# EAGLE design ESP32-DevBoard-Prototype (EAGLE 9.5.2)
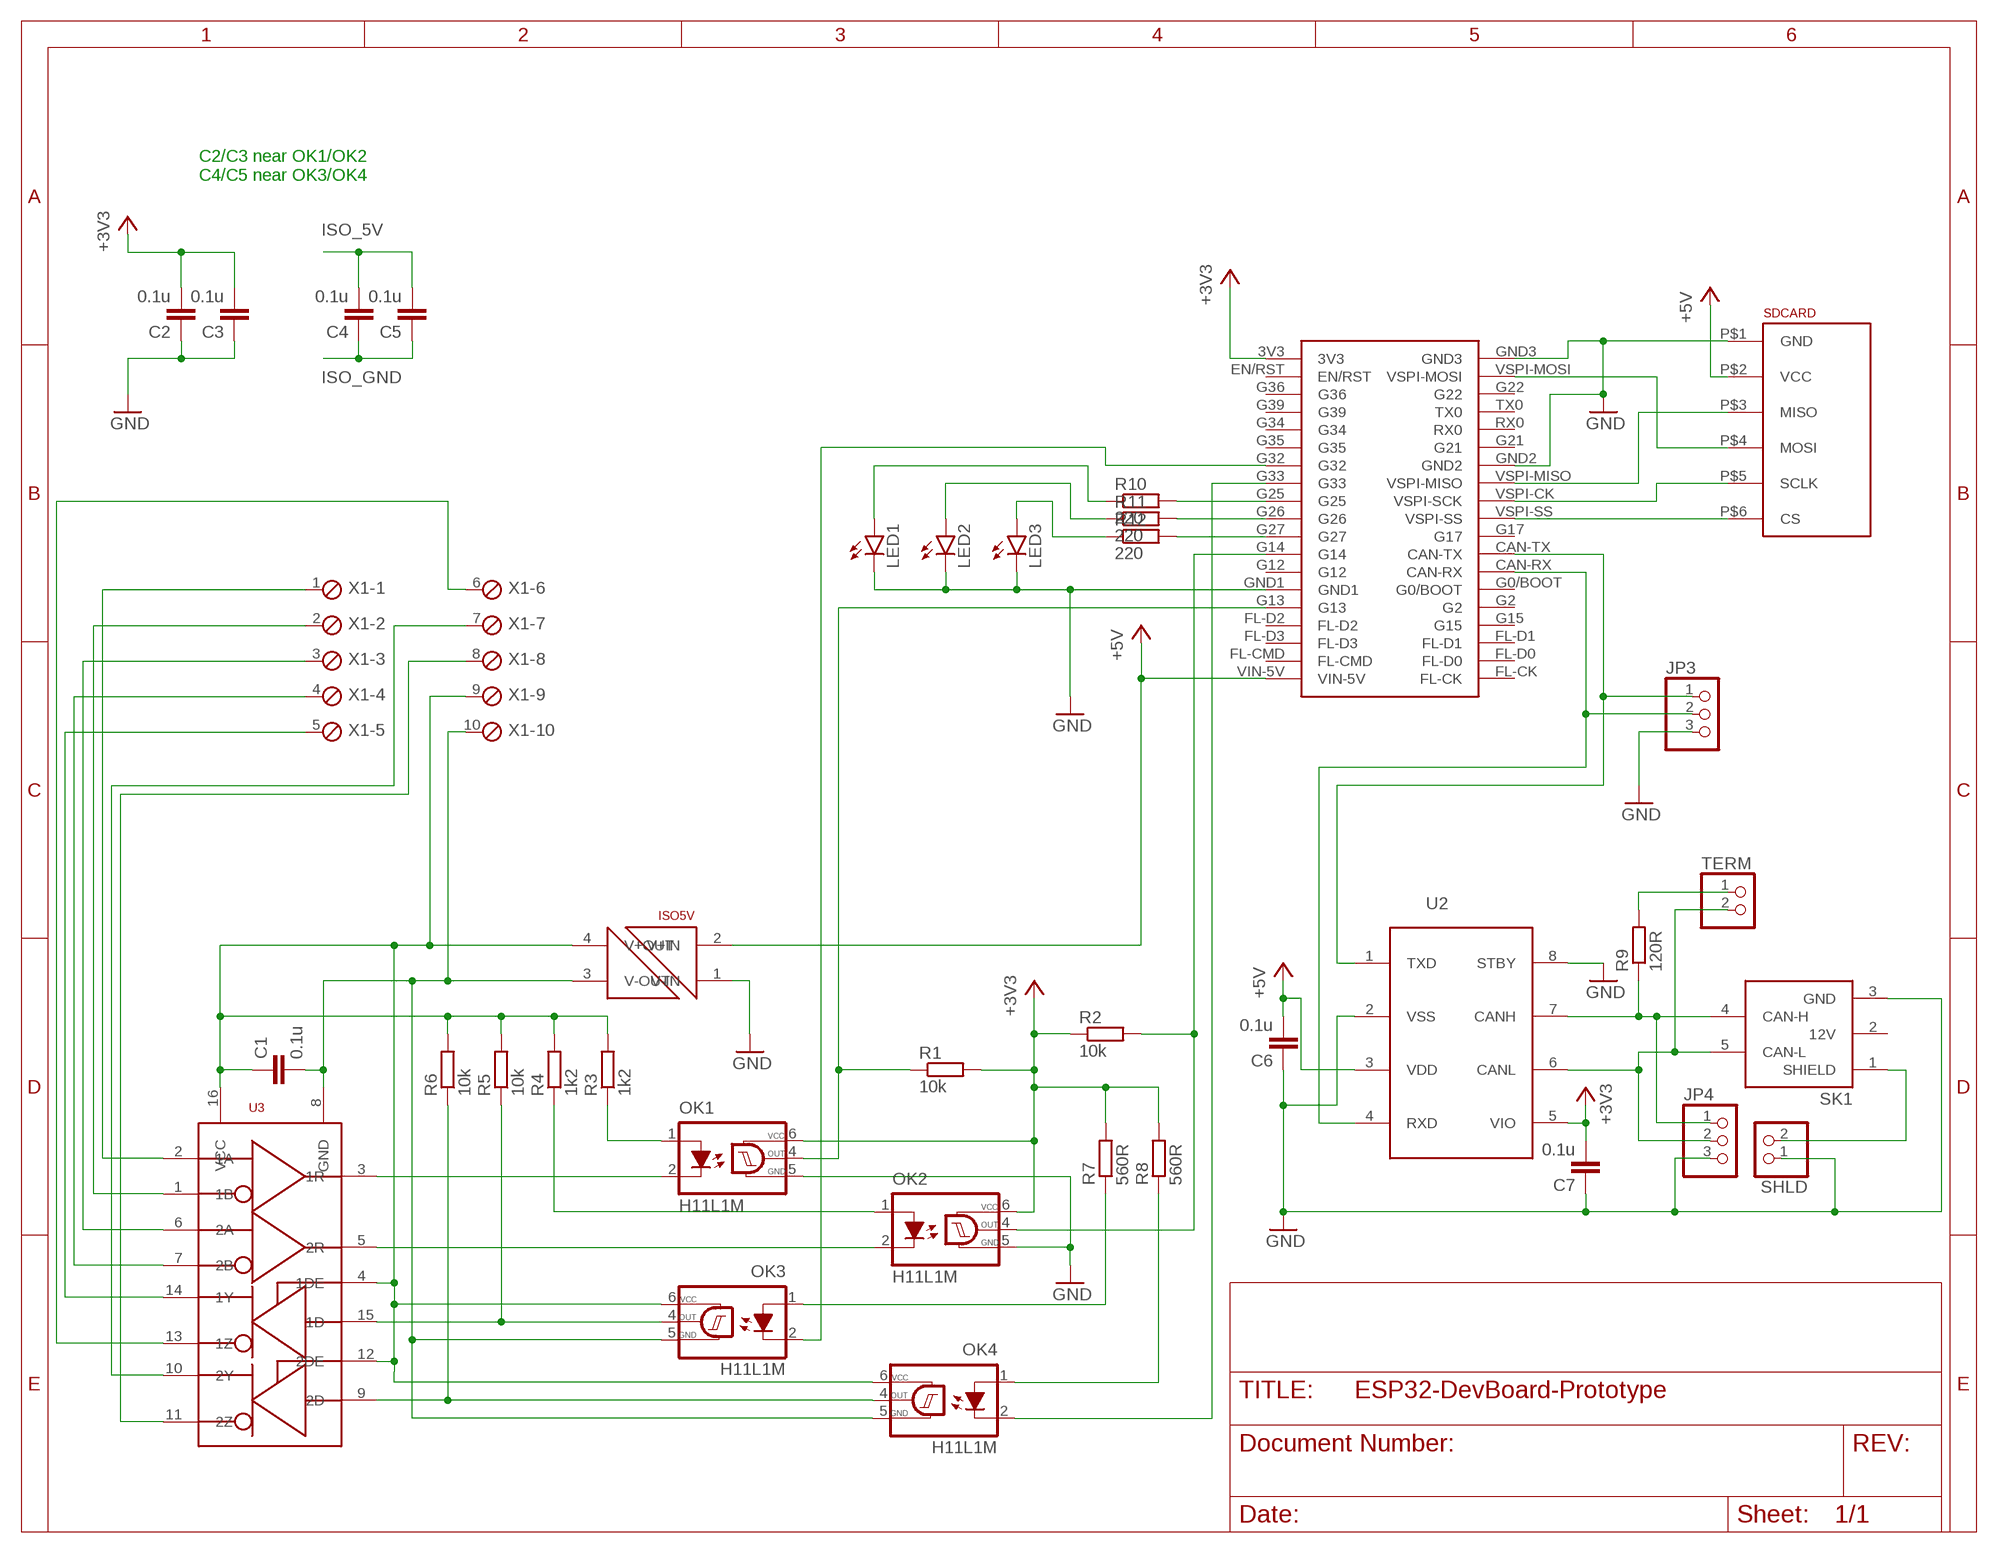
[diagram p0: schematic, sheet 1]

## Parts
C1  0.1u  C-EU050-025X075  [C050-025X075]
C2  0.1u  C-EU050-025X075  [C050-025X075]
C3  0.1u  C-EU050-025X075  [C050-025X075]
C4  0.1u  C-EU050-025X075  [C050-025X075]
C5  0.1u  C-EU050-025X075  [C050-025X075]
C6  0.1u  C-EU050-025X075  [C050-025X075]
C7  0.1u  C-EU050-025X075  [C050-025X075]
ISO5V  RFM-0505S  [RFM-0505S]
JP3  PINHD-1X3  [1X03]
JP4  PINHD-1X3  [1X03]
LED1  LED5MM  [LED5MM]
LED2  LED5MM  [LED5MM]
LED3  LED5MM  [LED5MM]
OK1  H11L1M  [DIL06]
OK2  H11L1M  [DIL06]
OK3  H11L1M  [DIL06]
OK4  H11L1M  [DIL06]
R1  10k  R-EU_0207/10  [0207/10]
R2  10k  R-EU_0207/10  [0207/10]
R3  1k2  R-EU_0207/10  [0207/10]
R4  1k2  R-EU_0207/10  [0207/10]
R5  10k  R-EU_0207/10  [0207/10]
R6  10k  R-EU_0207/10  [0207/10]
R7  560R  R-EU_0207/10  [0207/10]
R8  560R  R-EU_0207/10  [0207/10]
R9  120R  R-EU_0207/10  [0207/10]
R10  220  R-EU_0207/10  [0207/10]
R11  220  R-EU_0207/10  [0207/10]
R12  220  R-EU_0207/10  [0207/10]
SDCARD  MICROSD-BREAKOUT  [MICROSD-BREAKOUT]
SHLD  PINHD-1X2  [1X02]
SK1  NMEA2000-TOPSIDE  [NMEA2000-TOPSIDE]
TERM  PINHD-1X2  [1X02]
U1  ESP32-DEVBOARD  [ESP32-DEVBOARD]
U2  MCP2562-TH  [DIP8]
U3  SN65C1168  [DIP16]
X1  MPT10  [10POL254]

## Nets
+3V3: C2.2 C3.2 C7.2 OK1.6(VCC) OK2.6(VCC) R1.2 R2.1 R7.2 R8.2 U1.3V3 U2.5(VIO)
+5V: C6.2 ISO5V.2(V+IN) SDCARD.P$2(VCC) U1.VIN-5V U2.3(VDD)
GND: C2.1 C3.1 C6.1 C7.1 ISO5V.1(V-IN) JP3.3 JP4.3 LED1.K(C) LED2.K(C) LED3.K(C) OK1.5(GND) OK2.5(GND) SDCARD.P$1(GND) SHLD.1 SK1.3(GND) U1.GND1 U1.GND2 U1.GND3 U2.2(VSS) U2.8(STBY)
ISO_5V: C1.1 C4.2 C5.2 ISO5V.4(V+OUT) OK3.6(VCC) OK4.6(VCC) R3.2 R4.2 R5.2 R6.2 U3.4(1DE) U3.12(2DE) U3.16(VCC) X1.9
ISO_GND: C1.2 C4.1 C5.1 ISO5V.3(V-OUT) OK3.5(GND) OK4.5(GND) U3.8(GND) X1.10
N$1: JP3.1 U1.CAN-TX U2.1(TXD)
N$2: SDCARD.P$4(MOSI) U1.VSPI-MOSI
N$3: OK3.1(A) R7.1
N$4: OK1.2(C) U3.3(1R)
N$5: OK2.2(C) U3.5(2R)
N$6: OK3.4(OUT) R5.1 U3.15(1D)
N$7: OK4.4(OUT) R6.1 U3.9(2D)
N$8: OK1.4(OUT) R1.1 U1.G13
N$9: OK2.4(OUT) R2.2 U1.G14
N$10: OK1.1(A) R3.1
N$11: OK2.1(A) R4.1
N$12: OK4.1(A) R8.1
N$13: SDCARD.P$3(MISO) U1.VSPI-MISO
N$14: OK3.2(C) U1.G32
N$15: OK4.2(C) U1.G33
N$16: SDCARD.P$5(SCLK) U1.VSPI-CK(VSPI-SCK)
N$17: SDCARD.P$6(CS) U1.VSPI-SS
N$18: JP3.2 U1.CAN-RX U2.4(RXD)
N$19: JP4.1 R9.1 SK1.4(CAN-H) U2.7(CANH)
N$20: JP4.2 SK1.5(CAN-L) TERM.2 U2.6(CANL)
N$21: R9.2 TERM.1
N$22: U3.2(1A) X1.1
N$23: SHLD.2 SK1.1(SHIELD)
N$24: U3.1(1B) X1.2
N$25: U3.6(2A) X1.3
N$26: U3.7(2B) X1.4
N$27: U3.14(1Y) X1.5
N$28: U3.13(1Z) X1.6
N$29: U3.10(2Y) X1.7
N$30: R10.2 U1.G25
N$31: U3.11(2Z) X1.8
N$32: LED3.A R12.1
N$33: LED2.A R11.1
N$34: LED1.A R10.1
N$35: R11.2 U1.G26
N$36: R12.2 U1.G27
Unconnected: SK1.2(12V) U1.EN/RST U1.FL-CK U1.FL-CMD U1.FL-D0 U1.FL-D1 U1.FL-D2 U1.FL-D3 U1.G0/BOOT U1.G2 U1.G12 U1.G15 U1.G17 U1.G21 U1.G22 U1.G34 U1.G35 U1.G36 U1.G39 U1.RX0 U1.TX0

## Notes on the sheet
- C2/C3 near OK1/OK2
  C4/C5 near OK3/OK4

## Library data of the parts
C1-C7 = rcl:C-EU: CAPACITOR, European symbol; SPICEPREFIX: C
ISO5V = sb2030_logger:RFM-0505S
JP3 JP4 = pinhead:PINHD-1X3: PIN HEADER
LED1-LED3 = led:LED: LED OSRAM: - CHIPLED LG R971, LG N971, LY N971, LG Q971, LY Q971, LO R971, LY R971 LH N974, LH R974 LS Q976, LO Q976, LY Q976 LO Q996 - Hyper CHIPLED LW Q18S LB Q993, LB Q99A, LB R99A - SideLED LS A670, LO A670, LY A670, LG A670, LP A670 LB A673, LV A673, LT A673, LW A673 LH A674 LY A675 LS A676, LA A676, LO A676, LY A676, LW A676 LS A679, LY A679, LG A679 - Hyper Micro SIDELED® LS Y876, LA Y876, LO Y876, LY Y876 LT Y87S - SmartLED LW L88C, LW L88S LB L89C, LB L89S, LG L890 LS L89K, LO L89K, LY L89K LS L896, LA L896, LO L896, LY L896 - TOPLED LS T670, LO T670, LY T670, LG T670, LP T670 LSG T670, LSP T670, LSY T670, LOP T670, LYG T670 LG T671, LOG T671, LSG T671 LB T673, LV T673, LT T673, LW T673 LH T674 LS T676, LA T676, LO T676, LY T676, LB T676, LH T676, LSB T676, LW T676 LB T67C, LV T67C, LT T67C, LS T67K, LO T67K, LY T67K, LW E67C LS E67B, LA E67B, LO E67B, LY E67B, LB E67C, LV E67C, LT E67C LW T67C LS T679, LY T679, LG T679 LS T770, LO T770, LY T770, LG T770, LP T770 LB T773, LV T773, LT T773, LW T773 LH T774 LS E675, LA E675, LY E675, LS T675 LS T776, LA T776, LO T776, LY T776, LB T776 LHGB T686 LT T68C, LB T68C - Hyper Mini TOPLED® LB M676 - Mini TOPLED Santana® LG M470 LS M47K, LO M47K, LY M47K Source: http://www.osram.convergy.de LUXEON: - LUMILED® LXK2-PW12-R00, LXK2-PW12-S00, LXK2-PW14-U00, LXK2-PW14-V00 LXK2-PM12-R00, LXK2-PM12-S00, LXK2-PM14-U00 LXK2-PE12-Q00, LXK2-PE12-R00, LXK2-PE12-S00, LXK2-PE14-T00, LXK2-PE14-U00 LXK2-PB12-K00, LXK2-PB12-L00, LXK2-PB12-M00, LXK2-PB14-N00, LXK2-PB14-P00, LXK2-PB14-Q00 LXK2-PR12-L00, LXK2-PR12-M00, LXK2-PR14-Q00, LXK2-PR14-R00 LXK2-PD12-Q00, LXK2-PD12-R00, LXK2-PD12-S00 LXK2-PH12-R00, LXK2-PH12-S00 LXK2-PL12-P00, LXK2-PL12-Q00, LXK2-PL12-R00 Source: www.luxeon.com KINGBRIGHT: KA-3528ASYC Source: www.kingbright.com
OK1-OK4 = optocoupler:H11L*M: 6-Pin DIP Optocoupler Source: http://www.fairchildsemi.com/ds/H1/H11L2-M.pdf; MF: FAIRCHILD SEMICONDUCTOR; MPN: H11L1-M; OC_FARNELL: 1021127; OC_NEWARK: 72K8643
R1-R12 = rcl:R-EU_: RESISTOR, European symbol; SPICEPREFIX: R
SDCARD = sb2030_logger:MICROSD-BREAKOUT
SHLD TERM = pinhead:PINHD-1X2: PIN HEADER
SK1 = sb2030_logger:NMEA2000-TOPSIDE
U1 = sb2030_logger:ESP32-DEVBOARD
U2 = sb2030_logger:MCP2562-TH
U3 = sb2030_logger:SN65C1168
X1 = con-phoenix-254:MPT10: PHOENIX CONNECTOR; OC_FARNELL: unknown; OC_NEWARK: unknown

## Board
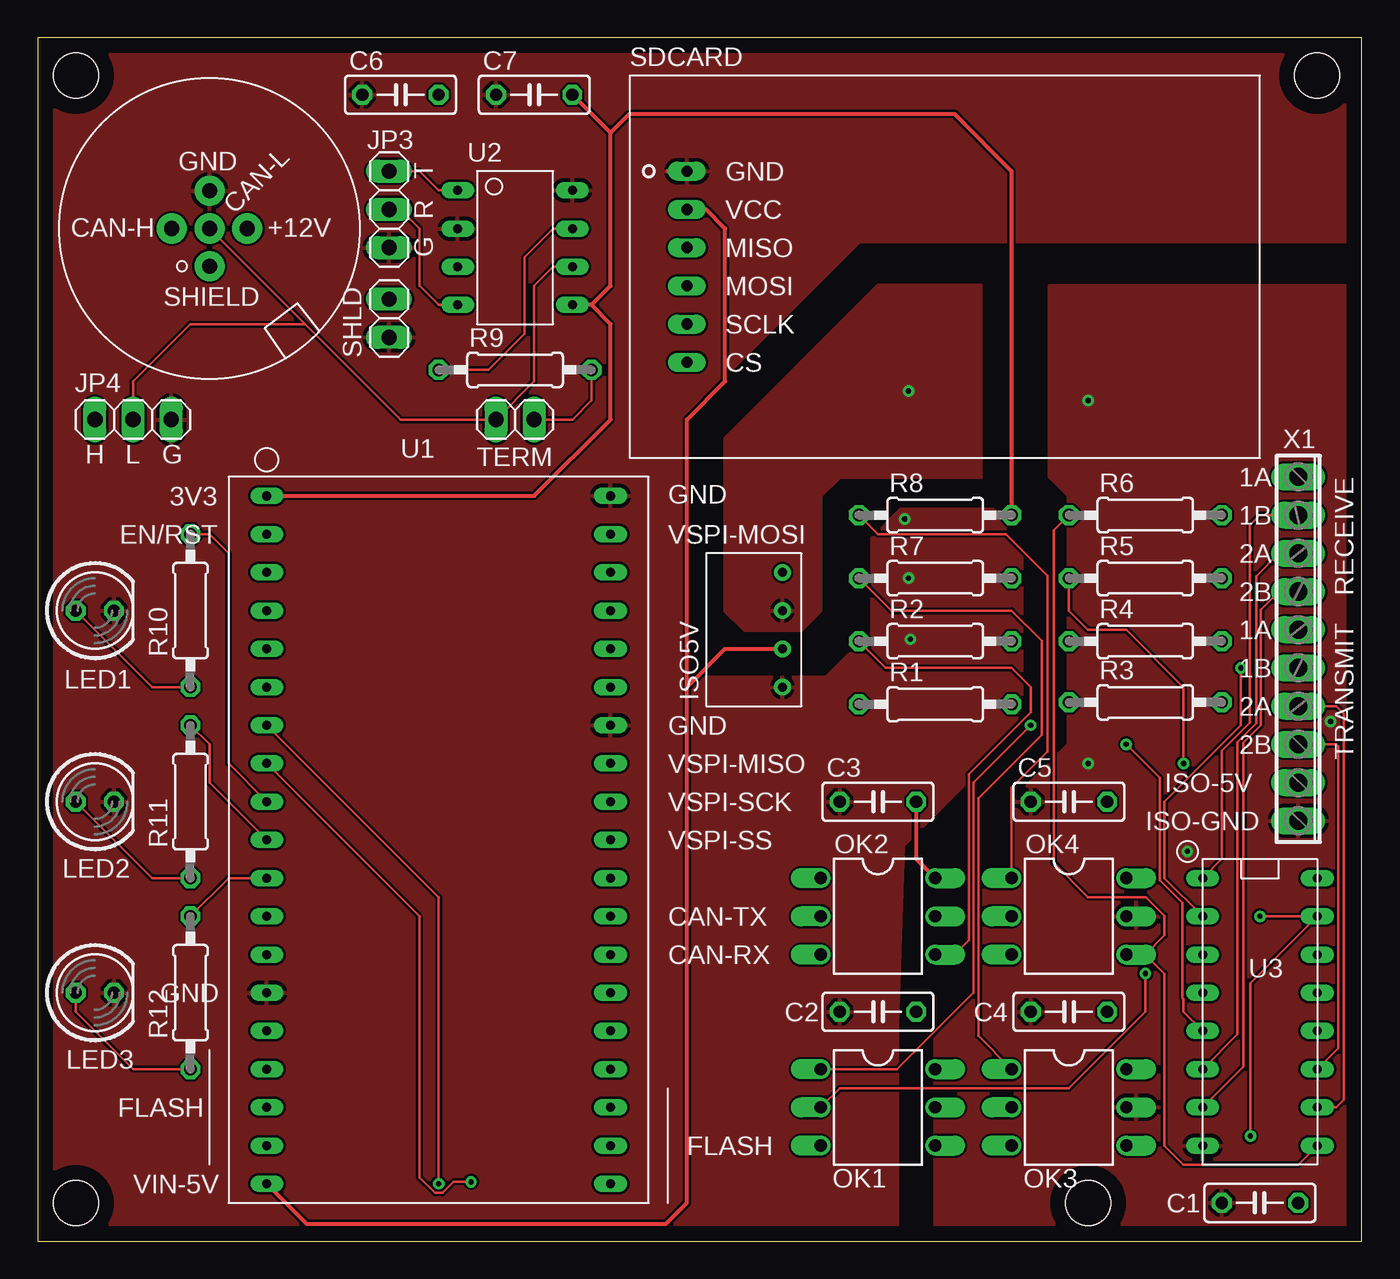
[diagram p1: board, top side]
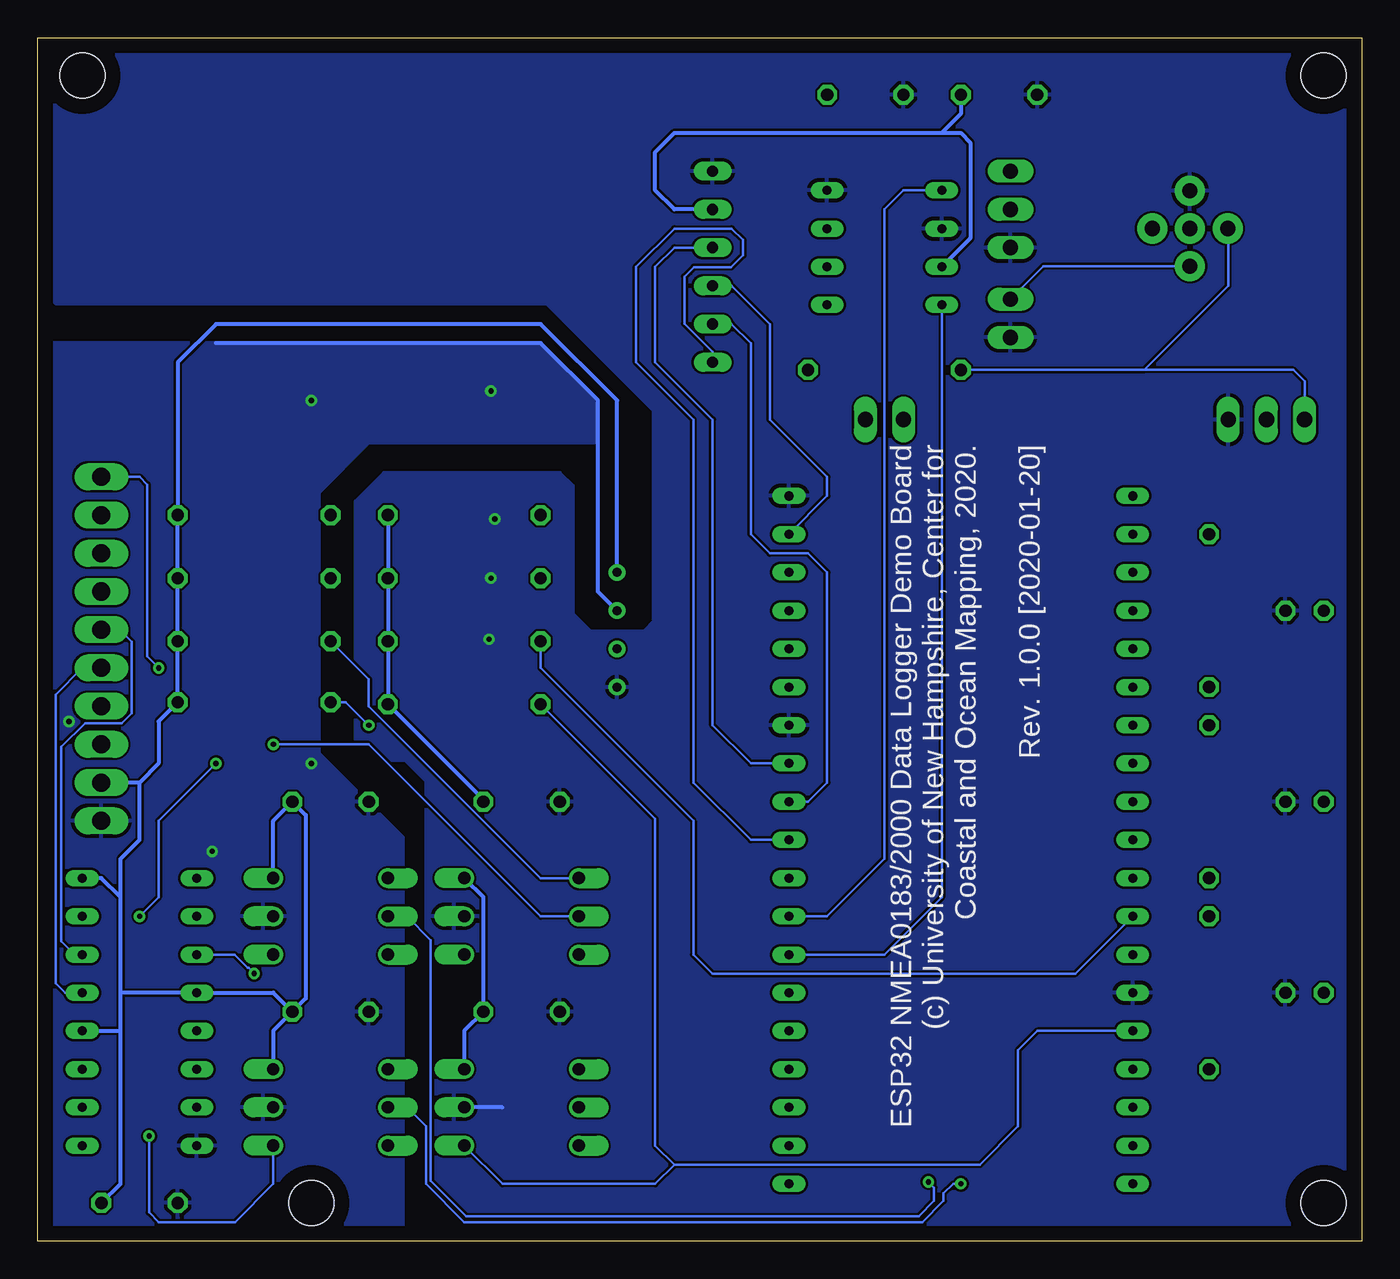
[diagram p2: board, bottom side, seen from below]

Size 88.06 x 80 mm. Coordinates in mm from the lower left corner, seen from the top.
Outline: 0,0 88.06,0 88.06,80 0,80 0,0
Copper layers (1*16): Top 0.035mm / dielectric 1.5mm / Bottom 0.035mm
Design rules "default": minimum track width 6mil, minimum drill 0.35mm, track to track 6mil, track to pad 6mil, pad to pad 6mil, via to via 6mil, smd to smd 6mil, copper to edge 40mil, drill to drill 6mil, minimum pad ring 10mil, minimum via ring 8mil, stop-mask expansion 4mil, vias tented up to drill 0mil, thermal gap 10mil
Holes 3 mm at 2.54,77.47 85.09,77.47 2.54,2.54 69.85,2.54

### Footprints (pad centres in the part's own frame; a part is rotated, then mirrored left to right if it is on the bottom)
C050-025X075 = drill 0.813 octagon: 1 -2.54,0; 2 2.54,0
RFM-0505S = drill 0.6: 1 -3.81,0; 2 -1.27,0; 3 1.27,0; 4 3.81,0
1X03 = drill 1.016 long: 1 -2.54,0; 2 0,0; 3 2.54,0
LED5MM = drill 0.813 octagon: A -1.27,0; K 1.27,0
DIL06 = drill 0.813 offset: 1 -2.54,-3.81; 2 0,-3.81; 3 2.54,-3.81; 4 2.54,3.81; 5 0,3.81; 6 -2.54,3.81
0207/10 = drill 0.813 octagon: 1 -5.08,0; 2 5.08,0
MICROSD-BREAKOUT = drill 0.75 long: P$1 -6.35,-17.78; P$2 -3.81,-17.78; P$3 -1.27,-17.78; P$4 1.27,-17.78; P$5 3.81,-17.78; P$6 6.35,-17.78
1X02 = drill 1.016 long: 1 -1.27,0; 2 1.27,0
NMEA2000-TOPSIDE = drill 1 pad 2: 1 0,-2.5; 2 2.5,0; 3 0,2.5; 4 -2.5,0; 5 0,0
ESP32-DEVBOARD = drill 0.6 long: 3V3 -11.43,20.32; CAN-RX 11.43,-10.16; CAN-TX 11.43,-7.62; EN/RST -11.43,17.78; FL-CK 11.43,-25.4; FL-CMD -11.43,-22.86; FL-D0 11.43,-22.86; FL-D1 11.43,-20.32; FL-D2 -11.43,-17.78; FL-D3 -11.43,-20.32; G0/BOOT 11.43,-12.7; G2 11.43,-15.24; G12 -11.43,-10.16; G13 -11.43,-15.24; G14 -11.43,-7.62; G15 11.43,-17.78; G17 11.43,-5.08; G21 11.43,7.62; G22 11.43,15.24; G25 -11.43,0; G26 -11.43,-2.54; G27 -11.43,-5.08; G32 -11.43,5.08; G33 -11.43,2.54; G34 -11.43,10.16; G35 -11.43,7.62; G36 -11.43,15.24; G39 -11.43,12.7; GND1 -11.43,-12.7; GND2 11.43,5.08; GND3 11.43,20.32; RX0 11.43,10.16; TX0 11.43,12.7; VIN-5V -11.43,-25.4; VSPI-CK 11.43,0; VSPI-MISO 11.43,2.54; VSPI-MOSI 11.43,17.78; VSPI-SS 11.43,-2.54
DIP8 = drill 0.6 long: 1 -3.81,3.81; 2 -3.81,1.27; 3 -3.81,-1.27; 4 -3.81,-3.81; 5 3.81,-3.81; 6 3.81,-1.27; 7 3.81,1.27; 8 3.81,3.81
DIP16 = drill 0.6 long: 1 -3.81,8.89; 2 -3.81,6.35; 3 -3.81,3.81; 4 -3.81,1.27; 5 -3.81,-1.27; 6 -3.81,-3.81; 7 -3.81,-6.35; 8 -3.81,-8.89; 9 3.81,-8.89; 10 3.81,-6.35; 11 3.81,-3.81; 12 3.81,-1.27; 13 3.81,1.27; 14 3.81,3.81; 15 3.81,6.35; 16 3.81,8.89
10POL254 = drill 1.2 long: 1 -11.43,0; 2 -8.89,0; 3 -6.35,0; 4 -3.81,0; 5 -1.27,0; 6 1.27,0; 7 3.81,0; 8 6.35,0; 9 8.89,0; 10 11.43,0

### Placement (x,y rotation side)
C1  81.28,2.54 180 top
C2  55.88,15.24 0 top
C3  55.88,29.21 0 top
C4  68.58,15.24 0 top
C5  68.58,29.21 0 top
C6  24.13,76.2 0 top
C7  33.02,76.2 0 top
ISO5V  49.53,40.64 90 top
JP3  23.37,68.58 270 top
JP4  6.35,54.61 0 top
LED1  3.81,41.91 0 top
LED2  3.81,29.21 0 top
LED3  3.81,16.51 0 top
OK1  55.88,8.89 270 top
OK2  55.88,21.59 270 top
OK3  68.58,8.89 270 top
OK4  68.58,21.59 270 top
R1  59.69,35.69 0 top
R2  59.69,39.88 180 top
R3  73.66,35.81 0 top
R4  73.66,39.88 0 top
R5  73.66,44.07 0 top
R6  73.66,48.26 0 top
R7  59.69,44.07 0 top
R8  59.69,48.26 0 top
R9  31.75,57.91 0 top
R10  10.16,41.91 90 top
R11  10.16,29.21 90 top
R12  10.16,16.51 90 top
SDCARD  60.96,64.77 270 top
SHLD  23.37,61.34 90 top
SK1  11.43,67.31 0 top
TERM  31.75,54.61 180 top
U1  26.67,29.21 0 top
U2  31.75,66.04 0 top
U3  81.28,15.24 0 top
X1  83.82,39.37 270 top

### Tracks (layer width: path | path; a pad name or v marks a point on that pad's centre or on a via)
+3V3
  Top 0.254: C7.2 38.1,73.66 | 38.1,73.66 38.1,63.5 36.83,62.23 | U1.3V3 33.02,49.53 38.1,54.61 38.1,60.96 36.83,62.23 | 36.83,62.23 U2.5 | OK2.6 58.42,25.4 C3.2 | 38.1,73.66 39.37,74.93 60.96,74.93 64.77,71.12 R8.2
  Bottom 0.254: OK2.6 58.42,22.86 C2.2 59.69,13.97 OK1.6 | R8.2 R7.2 R2.1 R1.2 58.42,29.34 C3.2
+5V
  Top 0.254: U1.VIN-5V 17.91,1.14 41.78,1.14 43.18,2.54 43.18,36.83 | 43.18,36.83 45.72,39.37 ISO5V.2 | 43.18,36.83 43.18,54.61 45.72,57.15 45.72,67.31 44.45,68.58 SDCARD.P$2
  Bottom 0.254: SDCARD.P$2 45.72,68.58 46.99,69.85 46.99,72.39 45.72,73.66 27.94,73.66 | 27.94,73.66 26.67,73.66 26.04,73.03 26.04,66.67 U2.3 | C6.2 26.67,74.93 27.94,73.66
GND  (via drill 0.35)
  Top 0.254: 41.91,71.12 SDCARD.P$1
  Bottom 0.254: 57.15,8.89 OK1.5
  other vias: 58.04,40.01 57.91,44.07 57.66,48.01
  pour Bottom: 0,0 0,80.01 88.14,80.01 88.27,79.88 88.27,63.75 86.87,62.36 54.23,62.36 47.12,55.24 47.12,41.4 46.99,41.27 47.75,40.51 51.31,40.51 52.45,41.66 52.45,50.16 53.34,51.05 65.02,51.05 66.93,49.15 66.93,33.02 65.91,32 63.63,32 62.23,30.61 62.23,-0.13 0.13,-0.13
  pour Top: 0,0 0,80.01 0.25,79.76 88.14,79.76 88.14,66.55 88.27,66.42 54.61,66.42 44.32,56.13 44.32,37.47 52.45,37.47 55.5,40.51 55.5,46.74 57.4,48.64 63.5,48.64 65.41,46.74 65.41,34.16 57.53,26.29 57.15,14.35 57.15,-0.13 57.28,-0.25 0.25,-0.25
ISO_5V
  Bottom 0.254: OK4.6 72.39,27.94 C5.2 70.23,28.32 70.23,16.13 C4.2 | C1.1 82.55,3.81 82.55,13.97 | 82.55,13.97 82.55,16.51 | 82.55,16.51 82.55,22.86 | 82.55,22.86 83.82,24.13 U3.16 | U3.12 82.55,13.97 | 82.55,16.51 U3.4 72.39,16.51 C4.2 | 81.28,30.48 80.01,31.75 80.01,34.54 R3.2 R4.2 R5.2 R6.2 78.74,58.42 76.2,60.96 54.61,60.96 49.53,55.88 ISO5V.4 | 81.28,30.48 X1.9 | 82.55,22.86 82.55,25.4 81.28,26.67 81.28,30.48 | C4.2 72.39,13.97 OK3.6
ISO_GND  (via drill 0.35)
  Bottom 0.254: ISO5V.3 50.8,43.18 50.8,55.88 54.61,59.69 76.2,59.69
  other vias: 57.91,56.52 69.85,55.88 85.98,34.54 69.85,31.75 76.45,25.91
  pour Bottom: 50.8,55.88 54.61,59.69 88.14,59.69 88.14,-0.13 64.14,-0.13 63.75,0.25 63.75,26.8 69.34,32.38 69.34,49.78 66.04,53.09 51.05,53.09 51.05,55.88
  pour Top: 59.69,0 59.69,24.13 68.58,33.02 68.58,49.53 67.31,50.8 67.31,63.5 87.88,63.5 88.14,63.25 88.14,0.51 87.63,0
  pour Top: 62.74,63.5 55.88,63.5 45.72,53.34 45.72,41.91 46.99,40.64 50.8,40.64 52.07,41.91 52.07,49.53 53.34,50.8 62.74,50.8
N$1
  Top 0.152: U2.1 26.67,69.85 25.4,71.12 JP3.1
  Bottom 0.152: U2.1 30.48,69.85 31.75,68.58 31.75,25.4 35.56,21.59 U1.CAN-TX
N$2
  Bottom 0.152: U1.VSPI-MOSI 35.56,49.53 35.56,50.8 39.37,54.61 39.37,60.96 41.91,63.5 SDCARD.P$4
N$3
  Top 0.152: R7.1 56.77,41.91 64.77,41.91 66.77,39.91 66.77,33.66 62.56,29.44 62.56,13.64 OK3.1
N$4  (via drill 0.35)
  Top 0.152: OK1.2 53.34,10.16 68.58,10.16 73.66,15.24 v73.66,17.78
  Bottom 0.152: v73.66,17.78 74.04,18.16 74.08,18.16 74.97,19.05 U3.3
N$5  (via drill 0.35)
  Top 0.152: v72.39,33.02 74.62,30.79 74.62,24 76.13,22.5 76.13,16.19 76.2,16.12 76.2,15.24 U3.5
  Bottom 0.152: OK2.2 54.61,21.59 66.04,33.02 v72.39,33.02
N$6  (via drill 0.35)
  Top 0.152: v80.64,6.99 80.64,17.14 U3.15 v81.28,21.59 | R5.1 68.58,41.91 69.85,40.64 72.39,40.64 76.2,36.83 v76.2,31.75
  Bottom 0.152: OK3.4 72.39,3.81 74.93,1.27 80.01,1.27 80.64,1.91 v80.64,6.99 | v76.2,31.75 80.01,27.94 80.01,22.86 v81.28,21.59
N$7
  Top 0.152: OK4.4 73.66,19.05 | 73.66,19.05 74.93,20.32 74.93,21.63 73.7,22.86 69.85,22.86 67.56,25.15 67.56,47.24 R6.1 | U3.9 83.82,5.08 76.2,5.08 74.93,6.35 74.93,17.78 73.66,19.05
N$8
  Bottom 0.152: U1.G13 21.59,13.97 22.86,12.7 22.86,7.62 25.4,5.08 45.72,5.08 | OK1.4 57.15,3.81 46.99,3.81 45.72,5.08 | R1.1 46.99,28.07 46.99,6.35 45.72,5.08
N$9
  Top 0.152: R2.2 56.39,38.1 64.77,38.1 66.04,36.83 66.04,35.15 61.92,31.03 61.92,20.02 60.96,19.05 OK2.4
  Bottom 0.152: R2.2 54.61,38.1 44.45,27.94 44.45,19.05 43.18,17.78 19.05,17.78 U1.G14
N$10  (via drill 0.35)
  Top 0.152: OK1.1 57.15,11.43 62.23,16.51 62.23,30.48 v66.04,34.29
  Bottom 0.152: v66.04,34.29 67.56,35.81 R3.1
N$11
  Bottom 0.152: R4.1 66.04,37.34 66.04,35.56 54.61,24.13 OK2.1
N$12
  Top 0.152: OK4.1 64.77,30.13 67.16,32.52 67.16,44.22 64.39,46.99 55.88,46.99 R8.1
N$13
  Bottom 0.152: U1.VSPI-MISO 40.64,31.75 43.18,34.29 43.18,54.61 46.99,58.42 46.99,64.77 45.72,66.04 SDCARD.P$3
N$14  (via drill 0.35)
  Top 0.152: U1.G32 26.67,22.86 v26.67,3.81
  Bottom 0.152: OK3.2 63.5,8.89 62.23,7.62 62.23,3.81 59.69,1.27 29.21,1.27 27.81,2.67 27.81,3.17 27.18,3.81 v26.67,3.81
N$15  (via drill 0.35)
  Top 0.152: v28.83,3.94 27.66,3.94 26.92,3.2 26.42,3.2 25.4,4.22 25.4,21.59 U1.G33
  Bottom 0.152: OK4.2 63.5,21.59 61.92,20.02 61.92,4.01 59.56,1.65 29.46,1.65 28.45,2.67 28.45,3.56 v28.83,3.94
N$16
  Bottom 0.152: U1.VSPI-CK 36.83,29.21 35.56,30.48 35.56,44.45 36.83,45.72 39.37,45.72 40.64,46.99 40.64,59.69 41.91,60.96 SDCARD.P$5
N$17
  Bottom 0.152: U1.VSPI-SS 40.64,26.67 44.45,30.48 44.45,54.61 48.26,58.42 48.26,64.77 45.72,67.31 41.91,67.31 41.15,66.55 41.15,65.53 41.94,64.74 44.42,64.74 45.05,64.11 45.05,60.99 43.18,59.12 SDCARD.P$6
N$18
  Top 0.152: U2.4 26.67,62.23 25.4,63.5 25.4,67.31 24.13,68.58 JP3.2
  Bottom 0.152: U2.4 27.94,22.86 31.75,19.05 U1.CAN-RX
N$19
  Top 0.152: U2.7 34.29,67.31 32.38,65.41 32.38,60.33 29.97,57.91 R9.1
  Bottom 0.152: R9.1 14.48,57.91 | 14.48,57.91 8.89,63.5 8.89,67.27 SK1.4 | JP4.1 3.81,57.15 4.57,57.91 14.48,57.91
N$20
  Top 0.152: U2.6 34.29,64.77 33.02,63.5 33.02,57.15 TERM.2 24.13,54.61 17.78,60.96 | SK1.5 17.78,60.96 | JP4.2 6.35,57.15 10.16,60.96 17.78,60.96
N$21
  Top 0.152: R9.2 36.83,55.88 35.56,54.61 TERM.1
N$22  (via drill 0.35)
  Top 0.152: v80.01,38.1 80.01,34.29 74.93,29.21 74.93,24.13 U3.2
  Bottom 0.152: X1.1 81.28,50.8 80.77,50.29 80.77,38.86 v80.01,38.1
N$23
  Bottom 0.152: SK1.1 21.17,64.81 SHLD.2
N$24
  Top 0.152: X1.2 81.28,48.26 80.62,47.6 80.62,34.47 78.74,32.59 78.74,25.4 U3.1
N$25
  Top 0.152: X1.3 82.55,45.72 81.03,44.2 81.03,34.41 79.78,33.17 79.78,13.74 U3.6
N$26
  Top 0.152: X1.4 82.55,43.18 81.33,41.96 81.33,34.29 80.16,33.12 80.16,11.58 U3.7
N$27
  Bottom 0.152: X1.5 82.59,40.64 81.79,39.84 81.79,35.09 82.45,34.43 84.91,34.43 86.49,32.85 86.49,19.94 85.6,19.05 U3.14
N$28
  Bottom 0.152: X1.6 85.09,38.1 86.87,36.32 86.87,17.14 86.23,16.51 U3.13
N$29
  Top 0.152: X1.7 86.36,35.56 86.87,35.05 86.87,9.4 86.36,8.89 U3.10
N$30
  Top 0.152: U1.G25 12.7,31.75 12.7,45.72 11.43,46.99 R10.2
N$31
  Top 0.152: X1.8 86.36,33.02 86.49,32.89 86.49,12.83 U3.11
N$32
  Top 0.152: R12.1 6.35,11.43 2.54,15.24 LED3.A
N$33
  Top 0.152: R11.1 7.62,24.13 LED2.A
N$34
  Top 0.152: R10.1 7.62,36.83 LED1.A
N$35
  Top 0.152: U1.G26 11.43,30.48 11.43,33.02 R11.2
N$36
  Top 0.152: U1.G27 12.7,24.13 R12.2

### Text on the board
tPlace: T | R | G | H | L | G | 1A | 1B | 2A | 2B | RECEIVE | 1A | 1B | 2A | 2B | TRANSMIT | ISO-5V | ISO-GND
bPlace: ESP32 NMEA0183/2000 Data Logger Demo Board / (c) University of New Hampshire, Center for / Coastal and Ocean Mapping, 2020. / / Rev. 1.0.0 [2020-01-20]